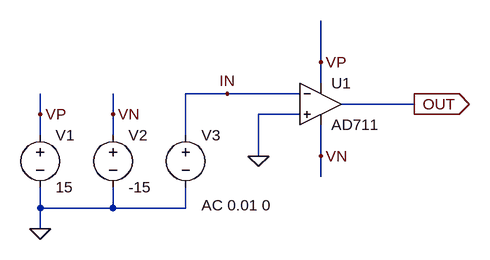
[diagram p0: schematic 増幅器ad711.asc]
増幅器ad711.asc, the LTspice schematic file:
Version 4
SHEET 1 880 680
WIRE 144 32 144 -32
WIRE 144 64 144 32
WIRE 0 80 -64 80
WIRE 112 80 0 80
WIRE 288 96 176 96
WIRE -288 112 -288 80
WIRE -176 112 -176 80
WIRE 112 112 48 112
WIRE -288 144 -288 112
WIRE -176 144 -176 112
WIRE -64 144 -64 80
WIRE 48 176 48 112
WIRE 144 176 144 128
WIRE 144 208 144 176
WIRE -288 256 -288 224
WIRE -176 256 -176 224
WIRE -176 256 -288 256
WIRE -64 256 -64 224
WIRE -64 256 -176 256
WIRE -288 288 -288 256
FLAG 48 176 0
FLAG -288 288 0
FLAG 288 96 OUT
IOPIN 288 96 Out
FLAG 144 32 VP
FLAG -288 112 VP
FLAG -176 112 VN
FLAG 144 176 VN
FLAG 0 80 IN
SYMBOL OpAmps/AD711 144 32 R0
SYMATTR InstName U1
SYMBOL voltage -288 128 R0
WINDOW 123 0 0 Left 0
WINDOW 39 0 0 Left 0
SYMATTR InstName V1
SYMATTR Value 15
SYMBOL voltage -176 128 R0
WINDOW 123 0 0 Left 0
WINDOW 39 0 0 Left 0
SYMATTR InstName V2
SYMATTR Value -15
SYMBOL voltage -64 128 R0
WINDOW 123 24 124 Left 2
WINDOW 39 0 0 Left 0
SYMATTR InstName V3
SYMATTR Value ""
SYMATTR Value2 AC 0.01 0

The netlist it stands for:
* 増幅器ad711.asc
XU1 0 IN VP VN OUT AD712  ; AD711, pins In+ In- V+ V- OUT
V1 VP 0 15
V2 VN 0 -15
V3 IN 0 AC 0.01 0
.lib ADI1.lib
.backanno
.end